# EAGLE design MINIL (EAGLE 7.6.0)
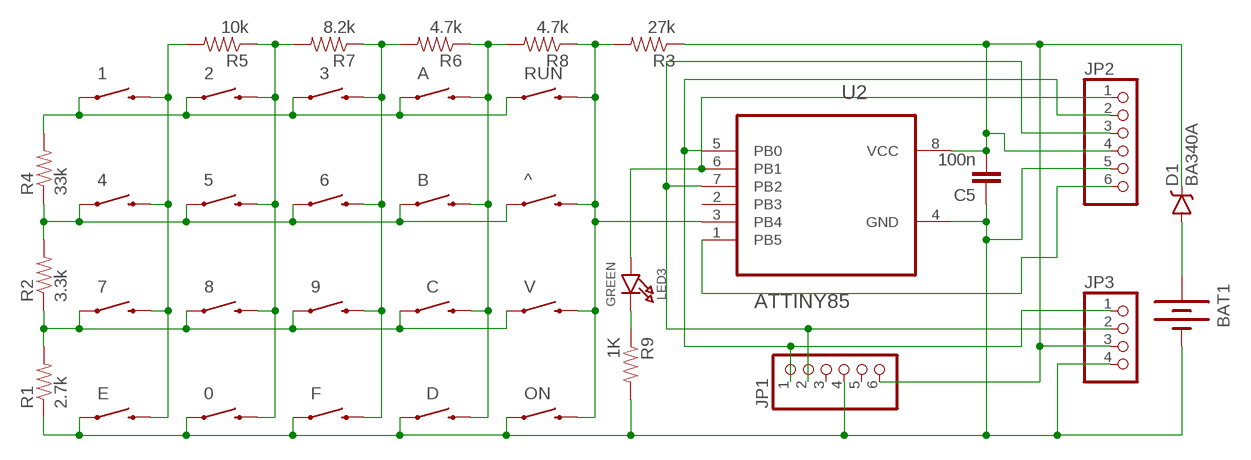
[diagram p0: schematic, sheet 1]

## Parts
0  SWITCH-MOMENTARY-2PTH  [TACTILE-PTH]
1  SWITCH-MOMENTARY-2PTH  [TACTILE-PTH]
2  SWITCH-MOMENTARY-2PTH  [TACTILE-PTH]
3  SWITCH-MOMENTARY-2PTH  [TACTILE-PTH]
4  SWITCH-MOMENTARY-2PTH  [TACTILE-PTH]
5  SWITCH-MOMENTARY-2PTH  [TACTILE-PTH]
6  SWITCH-MOMENTARY-2PTH  [TACTILE-PTH]
7  SWITCH-MOMENTARY-2PTH  [TACTILE-PTH]
8  SWITCH-MOMENTARY-2PTH  [TACTILE-PTH]
9  SWITCH-MOMENTARY-2PTH  [TACTILE-PTH]
^  SWITCH-MOMENTARY-2PTH  [TACTILE-PTH]
A  SWITCH-MOMENTARY-2PTH  [TACTILE-PTH]
B  SWITCH-MOMENTARY-2PTH  [TACTILE-PTH]
BAT1  BATTERYAAA-KIT  [BATTERY-AAA-KIT]
C  SWITCH-MOMENTARY-2PTH  [TACTILE-PTH]
C5  100n  CAP0603-CAP  [0603-CAP]
D  SWITCH-MOMENTARY-2PTH  [TACTILE-PTH]
D1  BA340A  B340A  [SMA-DIODE]
E  SWITCH-MOMENTARY-2PTH  [TACTILE-PTH]
F  SWITCH-MOMENTARY-2PTH  [TACTILE-PTH]
JP1  HEADER-1X6ROUND  [1X06_ROUND]
JP2  PINHD-1X6CLEAN  [1X06-CLEAN]
JP3  HEADER-1X4ROUND  [1X04_ROUND]
LED3  GREEN  LED0805_NOOUTLINE  [CHIPLED_0805_NOOUTLINE]
ON  SWITCH-MOMENTARY-2PTH  [TACTILE-PTH]
R1  2.7k  0.3OHM-1/8W-1%(0805)  [0805]
R2  3.3k  0.3OHM-1/8W-1%(0805)  [0805]
R3  27k  0.3OHM-1/8W-1%(0805)  [0805]
R4  33k  0.3OHM-1/8W-1%(0805)  [0805]
R5  10k  0.3OHM-1/8W-1%(0805)  [0805]
R6  4.7k  0.3OHM-1/8W-1%(0805)  [0805]
R7  8.2k  0.3OHM-1/8W-1%(0805)  [0805]
R8  4.7k  0.3OHM-1/8W-1%(0805)  [0805]
R9  1K  0.3OHM-1/8W-1%(0805)  [0805]
RUN  SWITCH-MOMENTARY-2PTH  [TACTILE-PTH]
U2  ATTINY85  ATTINY85-20SU  [SOIC127P798X216-8N]
V  SWITCH-MOMENTARY-2PTH  [TACTILE-PTH]

## Nets
COL3: 3.3 6.3 9.3 F.3 R6.2 R7.1
GND: 0.1 BAT1.GND@1(-) C5.1 D.1 E.1 F.1 JP1.4 JP2.5 JP3.4 ON.1 R1.1 R9.2 U2.4(GND)
N$1: JP1.1 JP2.2 JP3.1 U2.5(PB0)
N$2: JP1.2 JP2.3 JP3.2 U2.7(PB2)
N$3: JP2.1 LED3.A U2.6(PB1)
N$4: LED3.C R9.1
N$5: ^.3 ON.3 R3.2 R8.1 RUN.3 U2.3(PB4) V.3
N$7: 1.3 4.3 7.3 E.3 R5.2
N$9: 0.3 2.3 5.3 8.3 R5.1 R7.2
N$10: A.3 B.3 C.3 D.3 R6.1 R8.2
N$12: JP2.6 U2.1(PB5)
N$15: BAT1.PWR@1(+) D1.A
ROW1: 1.1 2.1 3.1 A.1 R4.2 RUN.1
ROW2: 4.1 5.1 6.1 ^.1 B.1 R2.2 R4.1
ROW3: 7.1 8.1 9.1 C.1 R1.2 R2.1 V.1
VCC: C5.2 D1.C JP1.6 JP2.4 JP3.3 R3.1 U2.8(VCC)
Unconnected: JP1.3 JP1.5 U2.2(PB3)

## Library data of the parts
0 1-9 ^ A B C D E F ON RUN V = SparkFun-Electromechanical:SWITCH-MOMENTARY-2: Various NO switches- pushbuttons, reed, etc; PROD_ID: SWCH-08441
BAT1 = SparkFun-Electromechanical:BATTERY: Battery Holders Various common sizes : AA, AAA, 18650 (PRT-12895), 20mm coin cell and 12mm coin cell. 20MM_4LEGS, BATT-10373; PROD_ID: BATT-08571
C5 = SparkFun-Capacitors:CAP: Capacitor Standard 0603 ceramic capacitor, and 0.1" leaded capacitor.
D1 = SparkFun-DiscreteSemi:B340A: Schottky Diode 3A-40V; PROD_ID: DIO-09886
JP1 = microbuilder:HEADER-1X6: PIN HEADER
JP2 = adafruit:PINHD-1X6: PIN HEADER
JP3 = microbuilder:HEADER-1X4: PIN HEADER
LED3 = microbuilder:LED: LED 0603 - 0603 Surface Mount Package 2mA: Green LED - Low Power (3.9mcd, 2ma, 1.7Vf) - Digikey: 475-2709-2-ND Orange LED - Low Power (9.8mcd, 2ma, 1.8Vf) - Digikey: 475-1194-2-ND Red LED - Low Power (5mcd, 2ma, 1.8Vf) - Digikey: 475-1195-2-ND Yellow LED - Low Power (7mcd, 2ma, 1.8Vf) - Digikey: 475-1196-2-ND 5mA: Blue LED - Low Power (17mcd, 5ma, 2.9Vf) - Digikey: LNJ937W8CRACT-ND 0805 - 0805 Surface Mount Package 2mA: Red LED (8.8mcd, 2mA, 1.8Vf, Clear) - Low Power [Digikey: 475-2510-1-ND] Green LED (5mcd, 2mA, 1.8Vf, Clear) - Low Power [Digikey: 475-2730-1-ND] Yellow LED (11.3mcd, 2mA, 1.8Vf, Clear) - Low Power [Digikey: 475-2555-1-ND] 20mA: Red LED (104mcd, 20mA, Diffused) - LS R976 [Digikey: 475-1278-6-ND] Red LED (12mcd, 20mA, 2.0Vf, Clear) - APT2012EC [Digikey: 754-1128-1-ND] Green LED (15mcd, 20mA, 2.2Vf, Clear) - APT2012GC [Digikey: 754-1131-1-ND] Orange LED (160mcd, 20mA, 2.1Vf, Clear) - APT2012SECK [Digikey: 754-1130-1-ND] 1206 - 1206 Surface Mount Package Green LED (26mcd, 20mA, Diffused) - LG N971 [Digikey: 475-1407-6-ND] Red LED (15mcd, 20mA, Diffused) - LH N974 [Digikey: 475-1416-6-ND] Cree - Cree High-Power Surface Mount LEDs XPEBWT-L1-0000-00D50 - White 111lm 350mA 2.9Vf 6200K 110° XTEAWT-00-0000-00000LEE3 - White 114lm 350mA 2.85Vf 5000K 115° Everlight - Everlight 45-21 Series Surface Mount LEDs 45-21/QK2C-B2832AC2CB2/2T - Warm White 2000mcd 20mA 3.25Vf 3050K 120° 45-21/LK2C-B38452C4CB2/2T - Nuetral White 2000mcd 20mA 3.25Vf 4150K 120° 45-21/LK2C-B50634C6CB2/2T - Cold White 2200mcd 20mA 3.25Vf 5650K 120° PLCC2 Reverse Mount LS T77K-J1L2-1-0-2-R18-Z - Red 11.25mcd 2mA 1.8Vf 630nm 120° LO T77K-L1M2-24-Z - Orange 19.6mcd 2mA 1.8Vf 606nm 120° LY T77K-K2M1-26-Z - Yellow 15.7mcd 2mA 1.8Vf 587nm 120°
R1-R9 = SparkFun-Resistors:0.3OHM-1/8W-1%(0805): RES-11622; PROD_ID: RES-11622; VALUE: 0.3
U2 = Atmel_By_element14_Batch_1-00:ATTINY85-20SU: 8-bit Microcontroller with In-System Programmable Flash; MPN: ATTINY85-20SU; OC_FARNELL: 1455164; OC_NEWARK: 58M3797; PACKAGE: SOIC-8; SUPPLIER: Atmel

## Board
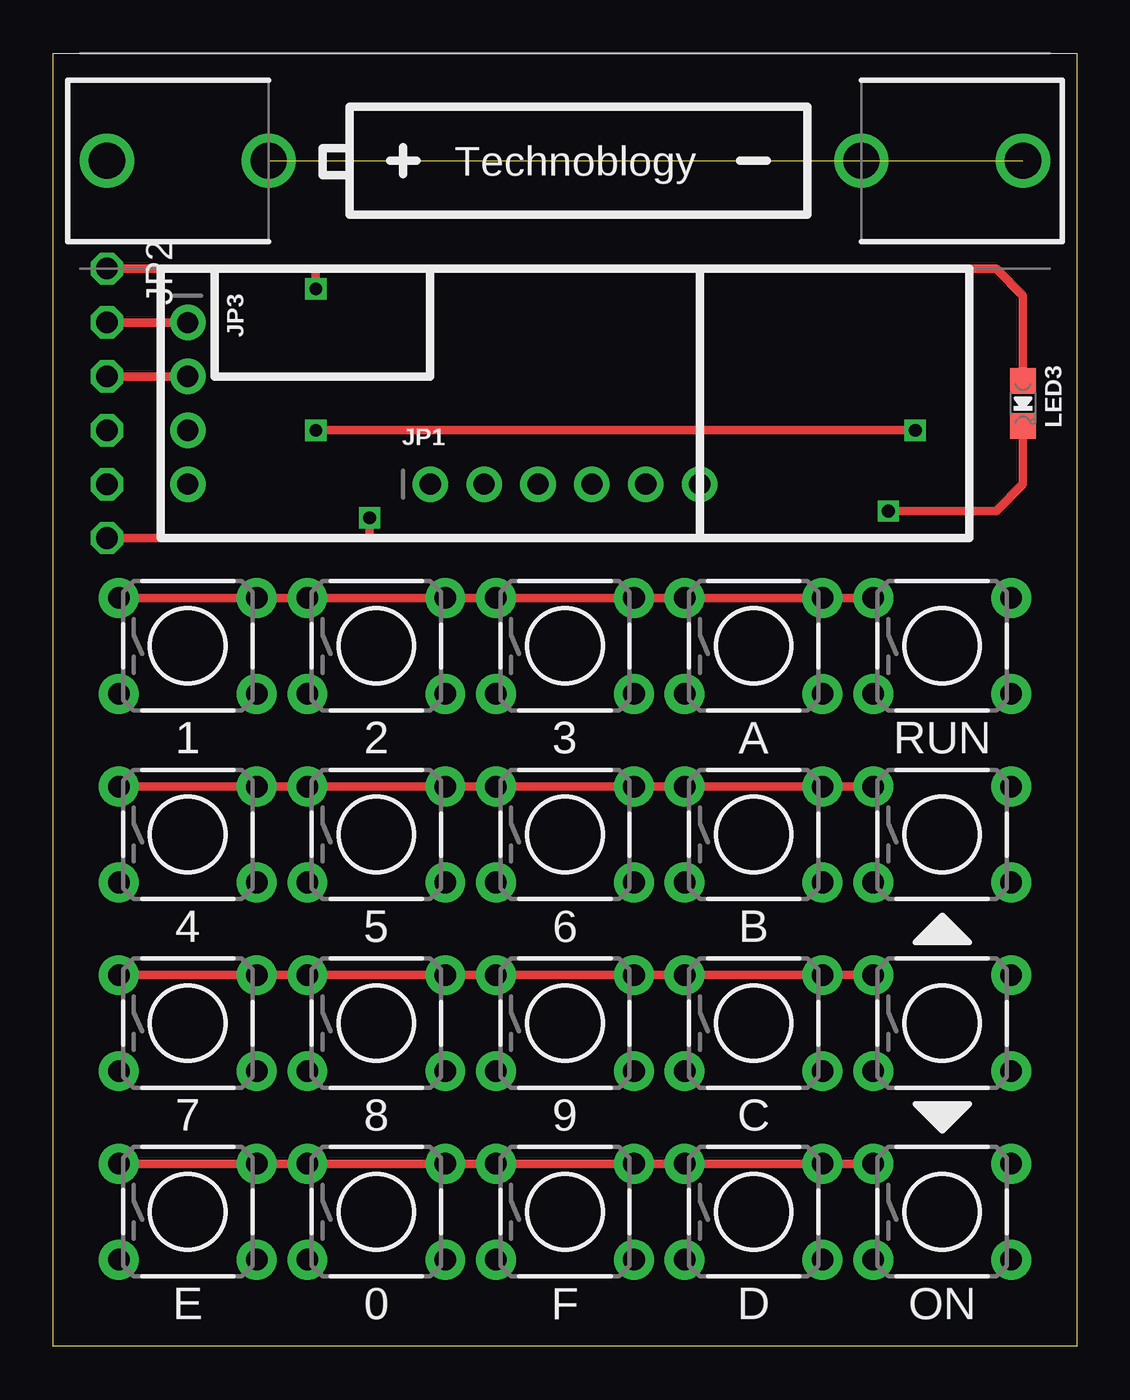
[diagram p1: board, top side]
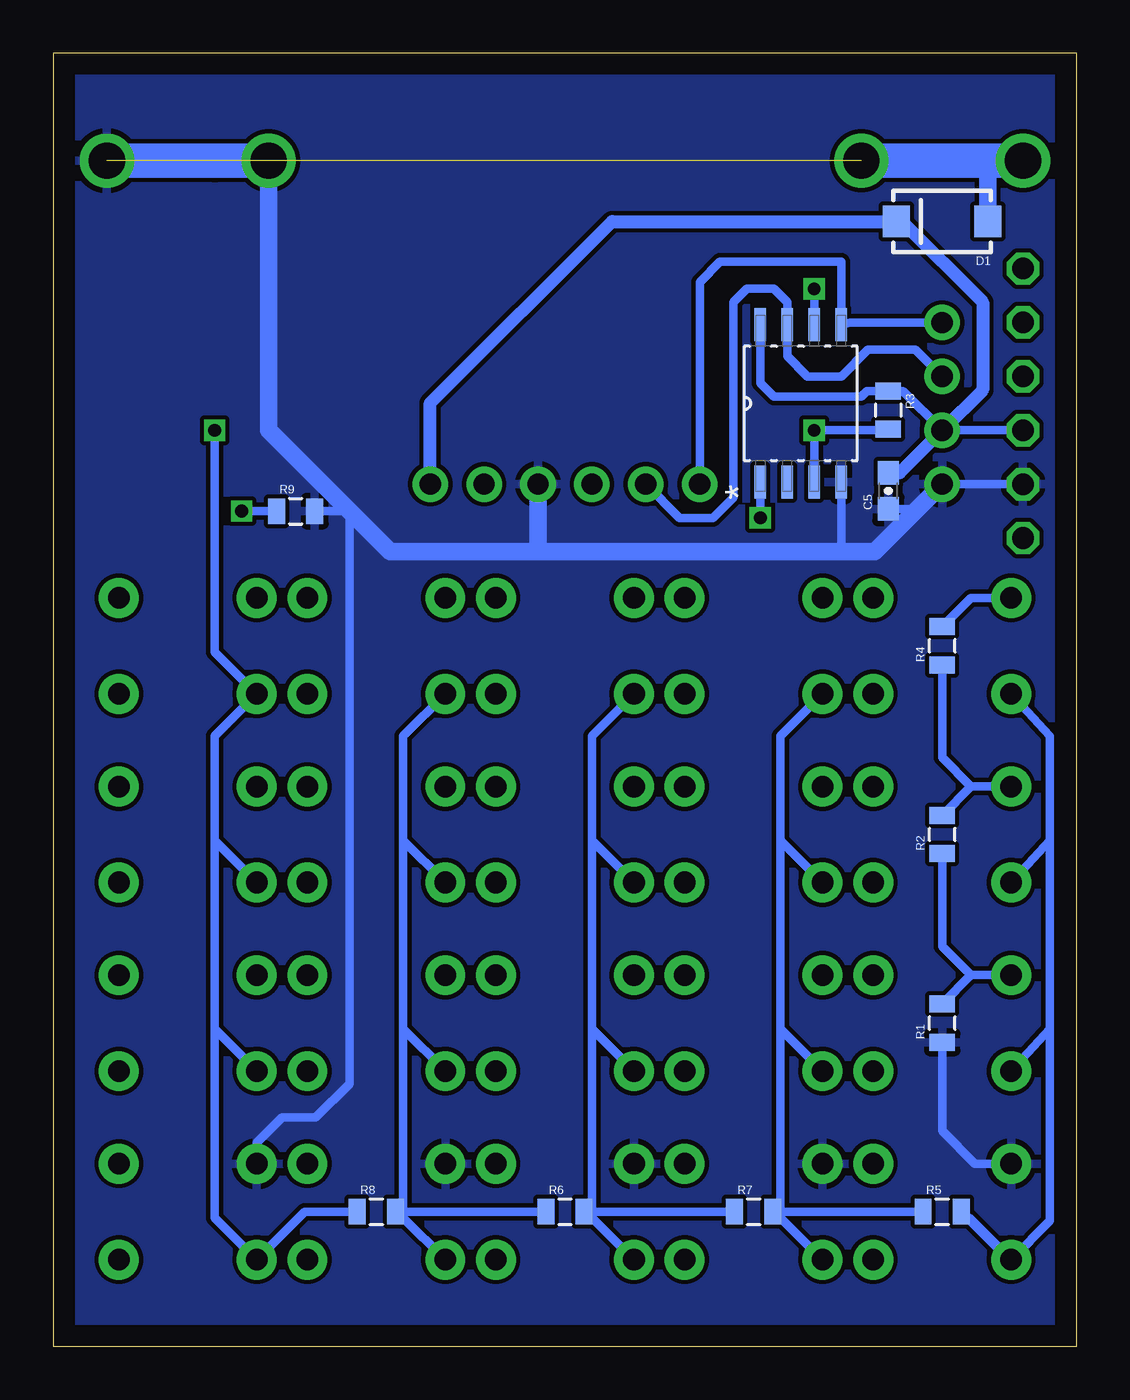
[diagram p2: board, bottom side, seen from below]

Size 48.26 x 60.96 mm. Coordinates in mm from the lower left corner, seen from the top.
Outline: 0,0 0,60.96 48.26,60.96 48.26,0 0,0
Copper layers (1*16): Top 0.035mm / dielectric 1.5mm / Bottom 0.035mm
Design rules "default": minimum track width 10mil, minimum drill 24mil, track to track 8mil, track to pad 8mil, pad to pad 8mil, via to via 8mil, smd to smd 8mil, copper to edge 40mil, drill to drill 8mil, minimum pad ring 10mil, minimum via ring 8mil, stop-mask expansion 4mil, vias tented up to drill 0mil, thermal gap 10mil

### Footprints (pad centres in the part's own frame; a part is rotated, then mirrored left to right if it is on the bottom)
TACTILE-PTH = drill 1.016 pad 1.88: 1 -3.251,2.261; 2 3.251,2.261; 3 -3.251,-2.261; 4 3.251,-2.261
BATTERY-AAA-KIT = drill 1.702: GND@1 21.59,0; GND@2 13.97,0; PWR@1 -21.59,0; PWR@2 -13.97,0
0603-CAP = smd 1.1 x 1: 1 -0.85,0; 2 0.85,0
SMA-DIODE = smd 1.27 x 1.47: A -2.15,0; C 2.15,0
1X06_ROUND = drill 1 pad 1.676: 1 -6.35,0; 2 -3.81,0; 3 -1.27,0; 4 1.27,0; 5 3.81,0; 6 6.35,0
1X06-CLEAN = drill 1.016 octagon: 1 -6.35,0; 2 -3.81,0; 3 -1.27,0; 4 1.27,0; 5 3.81,0; 6 6.35,0
1X04_ROUND = drill 1 pad 1.676: 1 -3.81,0; 2 -1.27,0; 3 1.27,0; 4 3.81,0
CHIPLED_0805_NOOUTLINE = smd 1.2 x 1.2: A 0,-1.05; C 0,1.05
0805 = smd 0.8 x 1.2: 1 -0.9,0; 2 0.9,0
SOIC127P798X216-8N = smd 1.549 x 0.533: 1 -3.708,1.905; 2 -3.708,0.635; 3 -3.708,-0.635; 4 -3.708,-1.905; 5 3.708,-1.905; 6 3.708,-0.635; 7 3.708,0.635; 8 3.708,1.905

### Placement (x,y rotation side)
0  15.24,6.35 0 top
1  6.35,33.02 0 top
2  15.24,33.02 0 top
3  24.13,33.02 0 top
4  6.35,24.13 0 top
5  15.24,24.13 0 top
6  24.13,24.13 0 top
7  6.35,15.24 0 top
8  15.24,15.24 0 top
9  24.13,15.24 0 top
^  41.91,24.13 0 top
A  33.02,33.02 0 top
B  33.02,24.13 0 top
BAT1  24.13,55.88 0 top
C  33.02,15.24 0 top
C5  8.89,40.32 90 bottom
D  33.02,6.35 0 top
D1  6.35,53.02 180 bottom
E  6.35,6.35 0 top
F  24.13,6.35 0 top
JP1  24.13,40.64 0 top
JP2  2.54,44.45 270 top
JP3  6.35,44.45 270 top
LED3  45.72,44.45 180 top
ON  41.91,6.35 0 top
R1  6.35,15.24 90 bottom
R2  6.35,24.13 90 bottom
R3  8.89,44.13 270 bottom
R4  6.35,33.02 90 bottom
R5  6.35,6.35 0 bottom
R6  24.13,6.35 0 bottom
R7  15.24,6.35 0 bottom
R8  33.02,6.35 0 bottom
R9  36.83,39.37 0 bottom
RUN  41.91,33.02 0 top
U2  13.02,44.45 90 bottom
V  41.91,15.24 0 top

### Tracks (layer width: path | path; a pad name or v marks a point on that pad's centre or on a via)
COL3
  Bottom 0.406: F.3 22.86,6.07 22.86,6.35 | 22.86,6.35 22.86,14.96 | 22.86,14.96 22.86,23.85 | 9.3 22.86,14.96 | 6.3 22.86,23.85 | 3.3 22.86,28.78 22.86,23.85 | R7.1 22.86,6.35 | R6.2 22.86,6.35
GND  (1 unrouted)
  Top 0.406: E.1 0.1 F.1 D.1 ON.1
  Bottom 0.406: R1.1 6.35,10.16 4.8,8.61 E.1 | ON.1 38.66,9.6 37.47,10.79 35.88,10.79 34.29,12.38 34.29,39.37 R9.2 | U2.4 11.11,37.47 | JP3.4 JP2.5 | C5.1 7.72,39.47 7.62,39.37
  Bottom 0.813: 25.4,37.47 11.11,37.47 9.53,37.47 7.62,39.37 JP3.4 | JP1.4 25.4,37.47 | 25.4,37.47 32.38,37.47 34.29,39.37 38.1,43.18 38.1,55.88
  pour Bottom: 0,60.96 48.26,60.96 48.26,0 0,0
N$1
  Top 0.406: JP3.1 JP2.2
  Bottom 0.406: JP3.1 10.69,48.26 U2.5 11.11,51.12 16.83,51.12 17.78,50.17 JP1.1
N$2
  Top 0.406: JP3.2 JP2.3
  Bottom 0.406: JP1.2 18.73,39.05 17.14,39.05 16.19,40.01 16.19,49.21 15.56,49.85 14.29,49.85 13.65,49.21 U2.7 13.65,46.67 12.7,45.72 11.11,45.72 9.84,46.99 7.62,46.99 JP3.2
N$3  (via drill 0.6)
  Top 0.406: v12.38,49.85 12.38,50.8 | 12.38,50.8 JP2.1 | LED3.A 45.72,49.53 44.45,50.8 12.38,50.8
  Bottom 0.406: U2.6 v12.38,49.85
N$4  (via drill 0.6)
  Top 0.406: LED3.C 45.72,40.64 44.45,39.37 v39.37,39.37
  Bottom 0.406: v39.37,39.37 R9.1
N$5  (via drill 0.6)
  Top 0.406: v40.64,43.18 v12.38,43.18
  Bottom 0.406: 40.64,14.96 40.64,6.07 ON.3 36.4,6.35 R8.1 | 40.64,14.96 40.64,23.85 | V.3 40.64,14.96 | ^.3 40.64,23.85 | 40.64,23.85 40.64,28.78 RUN.3 40.64,32.74 v40.64,43.18 | R3.2 8.94,43.18 v12.38,43.18 U2.3
N$7
  Bottom 0.406: E.3 5.08,6.07 | 1.27,14.96 1.27,5.92 E.3 | 1.27,14.96 1.27,23.85 | 7.3 1.27,14.96 | 4.3 1.27,23.85 | 1.3 1.27,28.78 1.27,23.85 | E.3 2.82,3.81 2.54,3.81 | R5.2 3.19,4.09 E.3
N$8  (1 unrouted)
  Bottom 0.406: 38.1,55.88 38.1,54.61 39.37,55.88 40.64,55.88
  Bottom 1.626: 2.54,55.88 10.16,55.88 | 38.1,55.88 40.64,55.88 45.72,55.88
N$9
  Bottom 0.406: 0.3 13.97,6.07 13.97,6.35 | 13.97,6.35 13.97,14.96 | 13.97,14.96 13.97,23.85 | 8.3 13.97,14.96 | 5.3 13.97,23.85 | 2.3 13.97,28.78 13.97,23.85 | R5.1 13.97,6.35 | R7.2 13.97,6.35
N$10
  Bottom 0.406: D.3 31.75,6.07 31.75,6.35 | 31.75,6.35 31.75,14.96 | 31.75,14.96 31.75,23.85 | C.3 31.75,14.96 | B.3 31.75,23.85 | A.3 31.75,28.78 31.75,23.85 | R6.1 31.75,6.35 | R8.2 31.75,6.35
N$12  (via drill 0.6)
  Top 0.406: v14.92,39.05 14.92,38.1 JP2.6
  Bottom 0.406: U2.1 v14.92,39.05
N$15
  Bottom 0.406: 4.2,55.49 3.81,55.88 BAT1.PWR@1
  Bottom 0.813: D1.A 4.2,55.49
ROW1
  Top 0.406: RUN.1 A.1 3.1 2.1 1.1
  Bottom 0.406: 12.7,35.28 2.1 | R4.2 4.99,35.28 1.1
ROW2
  Top 0.406: 4.1 5.1 6.1 B.1 ^.1
  Bottom 0.406: R2.2 4.99,26.39 | 4.99,26.39 4.1 | 4.99,26.39 6.35,27.75 R4.1
ROW3
  Top 0.406: 7.1 8.1 9.1 C.1 V.1
  Bottom 0.406: R1.2 4.99,17.5 | 4.99,17.5 7.1 | 4.99,17.5 6.35,18.86 R2.1
VCC
  Bottom 0.406: U2.8 14.92,45.4 14.29,44.77 10.16,44.77 9.89,45.03 R3.1 8.2,45.03 JP3.3 JP2.4 | D1.C 8.26,53.02 | C5.2 8.36,41.17
  Bottom 0.61: JP1.6 30.48,44.45 21.91,53.02 D1.C | 8.26,53.02 4.45,49.21 4.45,45.09 JP3.3 8.36,41.17

### Text on the board
tPlace: Technoblogy